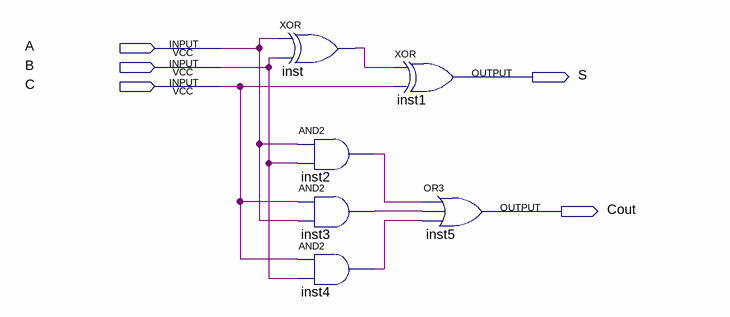
[diagram p0: schematic sheet]
// Quartus schematic fa1bit.bdf as structural Verilog: 6 symbols, 5 pins
module fa1bit (
  input  A,
  input  B,
  input  C,
  output S,
  output Cout
);

  wire inst2_out, inst3_out, inst4_out, inst_out;

  xor inst (inst_out, A, B);
  and inst2 (inst2_out, A, B);
  and inst3 (inst3_out, C, A);
  and inst4 (inst4_out, C, B);
  xor inst1 (S, inst_out, C);
  or inst5 (Cout, inst2_out, inst3_out, inst4_out);
endmodule
